# Altium schematic sheet main.SchDoc
size 317 x 281 mm; SheetNumber: 1; SheetTotal: 1
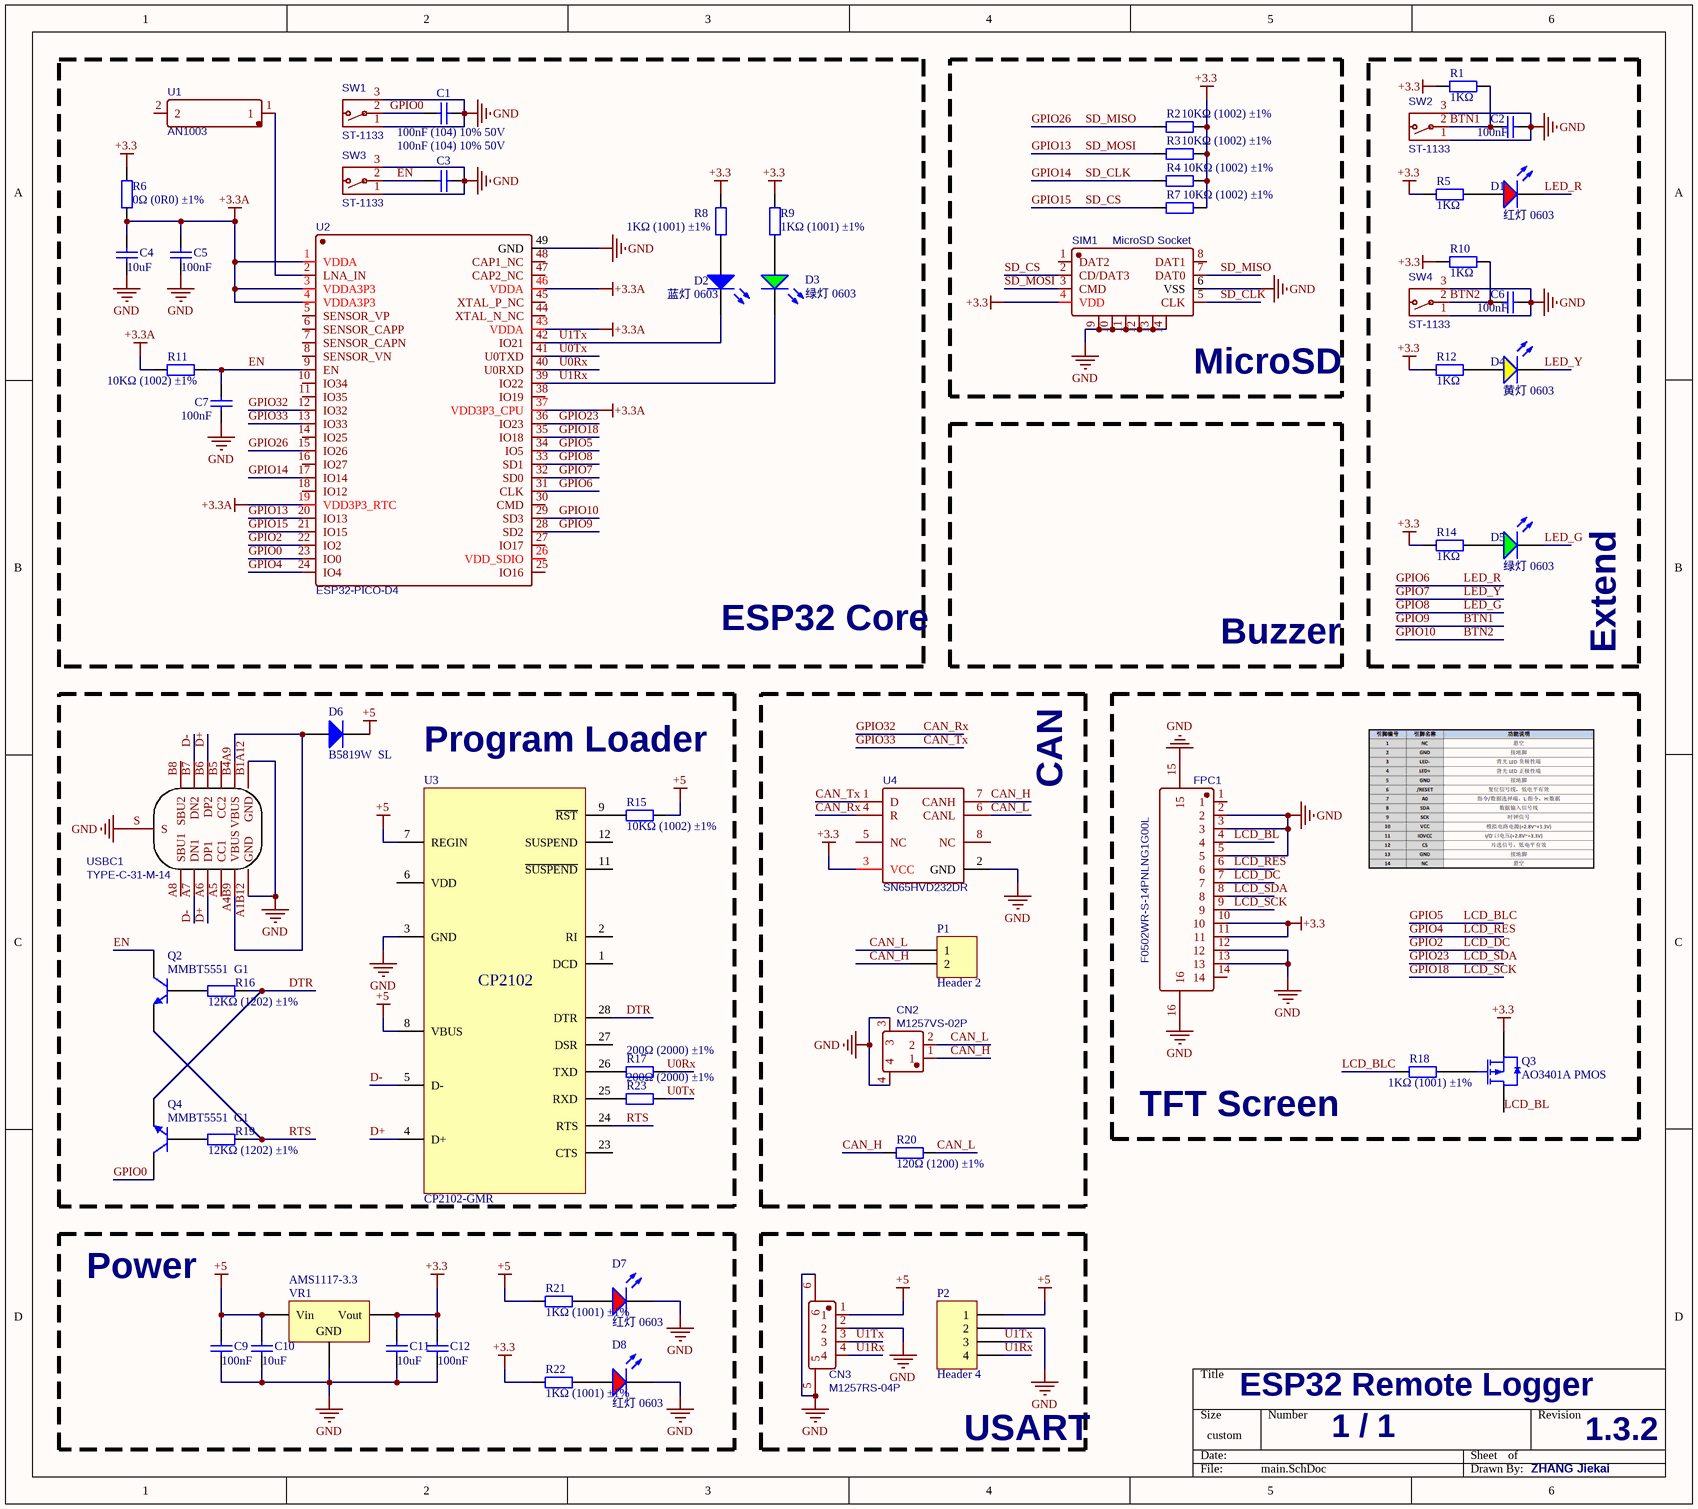
[diagram p0: main.SchDoc]

## Parts
C1  100nF (104) 10% 50V  [0603_C]
C2  100nF  [0603_C]
C3  100nF (104) 10% 50V  [0603_C]
C4  10uF  [0603_C]
C5  100nF  [0603_C]
C6  100nF  [0603_C]
C7  100nF  [0603_C]
C9  100nF  [0603_C]
C10  10uF  [0603_C]
C11  10uF  [0603_C]
C12  100nF  [0603_C]
CN2  M1257VS-02P  [CONN-SMD_P1.25_M1257VS-02P]
CN3  M1257RS-04P  [CONN-SMD_M1257RS-04P]
D1  红灯 0603  [0603_LED_S1]
D2  蓝灯 0603  [0603_LED_S1]
D3  绿灯 0603  [0603_LED_S1]
D4  黄灯 0603  [0603_LED_S1]
D5  绿灯 0603  [0603_LED_S1]
D6  B5819W  SL  [SOD-123]
D7  红灯 0603  [0603_LED_S1]
D8  红灯 0603  [0603_LED_S1]
FPC1  F0502WR-S-14PNLNG1G00L  [FPC-SMD_P0.50-14P_F0500WR-S]
P1  Header 2  [HDR1X2]
P2  Header 4  [HDR1X4]
Q2  MMBT5551  G1  [SOT-23(SOT-23-3)]
Q3  AO3401A PMOS  [SOT-23-3L]
Q4  MMBT5551  G1  [SOT-23(SOT-23-3)]
R1  1KΩ  [0603_R]
R2  10KΩ (1002) ±1%  [0603_R]
R3  10KΩ (1002) ±1%  [0603_R]
R4  10KΩ (1002) ±1%  [0603_R]
R5  1KΩ  [0603_R]
R6  0Ω (0R0) ±1%  [0603_R]
R7  10KΩ (1002) ±1%  [0603_R]
R8  1KΩ (1001) ±1%  [0603_R]
R9  1KΩ (1001) ±1%  [0603_R]
R10  1KΩ  [0603_R]
R11  10KΩ (1002) ±1%  [0603_R]
R12  1KΩ  [0603_R]
R14  1KΩ  [0603_R]
R15  10KΩ (1002) ±1%  [0603_R]
R16  12KΩ (1202) ±1%  [0603_R]
R17  200Ω (2000) ±1%  [0603_R]
R18  1KΩ (1001) ±1%  [0603_R]
R19  12KΩ (1202) ±1%  [0603_R]
R20  120Ω (1200) ±1%  [0603_R]
R21  1KΩ (1001) ±1%  [0603_R]
R22  1KΩ (1001) ±1%  [0603_R]
R23  200Ω (2000) ±1%  [0603_R]
SIM1  MicroSD Socket  [SIM-SMD_8P-1040310811]
SW1  ST-1133  [KEY-SMD_ST-1133]
SW2  ST-1133  [KEY-SMD_ST-1133]
SW3  ST-1133  [KEY-SMD_ST-1133]
SW4  ST-1133  [KEY-SMD_ST-1133]
U1  AN1003  [ANT-SMD_L10.3-W3.0]
U2  ESP32-PICO-D4  [QFN-48_L7.0-W7.0-P0.50-BL-EP5.4]
U3  CP2102-GMR  [QFN-28_5x5x05P]
U4  SN65HVD232DR  [SOIC-8_L5.0-W4.0-P1.27-LS6.0-BL]
USBC1  TYPE-C-31-M-14  [USB-C-SMD_12P-P0.50-H-F_TYPE-C-31-M-14]
VR1  AMS1117-3.3  [SOT-223]

## Blocks framed on the sheet
ESP32 Core: C1 C3-C5 C7 D2 D3 R6 R8 R9 R11 SW1 SW3 U1 U2
MicroSD: R2-R4 R7 SIM1
Extend: C2 C6 D1 D4 D5 R1 R5 R10 R12 R14 SW2 SW4
Program Loader: D6 Q2 Q4 R15-R17 R19 R23 U3 USBC1
CAN: CN2 P1 R20 U4
TFT Screen: FPC1 Q3 R18
Power: C9-C12 D7 D8 R21 R22 VR1
USART: CN3 P2

## Nets
+3.3: C11.2 C12.2 FPC1.10 FPC1.11 Q3.2(S) R1.2 R2.2 R3.2 R4.2 R5.2 R6.2 R7.2 R8.2 R9.2 R10.2 R12.2 R14.2 R22.1 SIM1.4(VDD) U4.3(VCC) VR1.2(Vout)
+3.3A: C4.2 C5.2 R6.1 R11.1 U2.1(VDDA) U2.3(VDDA3P3) U2.4(VDDA3P3) U2.19(VDD3P3_RTC) U2.37(VDD3P3_CPU) U2.43(VDDA) U2.46(VDDA)
+5: C9.2 C10.2 CN3.1 D6.2(K) P2.1 R15.2 R21.1 U3.7(REGIN) U3.8(VBUS) VR1.3(Vin)
GND: C1.2 C2.2 C3.2 C4.1 C5.1 C6.2 C7.1 C9.1 C10.1 C11.1 C12.1 CN2.3 CN2.4 CN3.2 CN3.5 CN3.6 D7.K D8.K FPC1.2 FPC1.3 FPC1.5 FPC1.12 FPC1.13 FPC1.15 FPC1.16 P2.2 SIM1.6(VSS) SIM1.9 SIM1.10 SIM1.11 SIM1.12 SIM1.13 SIM1.14 SW1.1 SW1.3 SW2.1 SW2.3 SW3.1 SW3.3 SW4.1 SW4.3 U2.49(GND) U3.3(GND) U4.2(GND) USBC1.A1B12(GND) USBC1.B1A12(GND) USBC1.S VR1.1(GND)
BTN1: C2.1 R1.1 SW2.2 U2.28(SD2)  [also labelled GPIO9]
BTN2: C6.1 R10.1 SW4.2 U2.29(SD3)  [also labelled GPIO10]
CAN_H: CN2.1 P1.2 R20.1 U4.7(CANH)
CAN_L: CN2.2 P1.1 R20.2 U4.6(CANL)
CAN_Rx: U2.12(IO32) U4.4(R)  [also labelled GPIO32]
CAN_Tx: U2.13(IO33) U4.1(D)  [also labelled GPIO33]
D+: U3.4(D+) USBC1.A6(DP1) USBC1.B6(DP2)
D-: U3.5(D-) USBC1.A7(DN1) USBC1.B7(DN2)
DTR: Q4.2(E) R16.2 U3.28(DTR)
EN: C3.1 C7.2 Q2.3(C) R11.2 SW3.2 U2.9(EN)
GPIO0: C1.1 Q4.3(C) SW1.2 U2.23(IO0)
GPIO2: FPC1.7 U2.22(IO2)  [also labelled LCD_DC]
GPIO4: FPC1.6 U2.24(IO4)  [also labelled LCD_RES]
GPIO5: R18.1 U2.34(IO5)  [also labelled LCD_BLC]
GPIO6: D1.K U2.31(CLK)  [also labelled LED_R]
GPIO7: D4.K U2.32(SD0)  [also labelled LED_Y]
GPIO8: D5.K U2.33(SD1)  [also labelled LED_G]
GPIO13: R3.1 SIM1.3(CMD) U2.20(IO13)  [also labelled SD_MOSI]
GPIO14: R4.1 SIM1.5(CLK) U2.17(IO14)  [also labelled SD_CLK]
GPIO15: R7.1 SIM1.2(CD/DAT3) U2.21(IO15)  [also labelled SD_CS]
GPIO18: FPC1.9 U2.35(IO18)  [also labelled LCD_SCK]
GPIO23: FPC1.8 U2.36(IO23)  [also labelled LCD_SDA]
GPIO26: R2.1 SIM1.7(DAT0) U2.15(IO26)  [also labelled SD_MISO]
LCD_BL: FPC1.4 Q3.3(D)
RTS: Q2.2(E) R19.2 U3.24(RTS)
U0Rx: R17.2 U2.40(U0RXD)
U0Tx: R23.2 U2.41(U0TXD)
U1Rx: CN3.4 D3.K P2.4 U2.39(IO22)
U1Tx: CN3.3 D2.K P2.3 U2.42(IO21)
NetD1_A: D1.A R5.1
NetD2_A: D2.A R8.1
NetD3_A: D3.A R9.1
NetD4_A: D4.A R12.1
NetD5_A: D5.A R14.1
NetD6_1: D6.1(A) USBC1.A4B9(VBUS) USBC1.B4A9(VBUS)
NetD7_A: D7.A R21.2
NetD8_A: D8.A R22.2
NetQ2_1: Q2.1(B) R16.1
NetQ3_1: Q3.1(G) R18.2
NetQ4_1: Q4.1(B) R19.1
NetR15_1: R15.1 U3.9(~{RST})
NetR17_1: R17.1 U3.26(TXD)
NetR23_1: R23.1 U3.25(RXD)
NetU1_1: U1.1 U2.2(LNA_IN)

Not connected (* = marked no-connect by the designer): FPC1 1 14; SIM1 1(DAT2) 8(DAT1); U1 2; U2 5(SENSOR_VP) 6(SENSOR_CAPP) 7(SENSOR_CAPN) 8(SENSOR_VN) 10(IO34) 11(IO35) 14(IO25) 16(IO27) 18(IO12) 25(IO16) 26(VDD_SDIO) 27(IO17) 30(CMD) 38(IO19) 44(XTAL_N_NC) 45(XTAL_P_NC) 47(CAP2_NC) 48(CAP1_NC); U3 1(DCD) 2(RI) 6(VDD) 11(~{SUSPEND}) 12(SUSPEND) 23(CTS) 27(DSR); U4 5(NC) 8(NC); USBC1 A5(CC1) A8(SBU1) B5(CC2) B8(SBU2)

## Notes on the sheet
- Buzzer
- ESP32 Remote Logger
- 1 / 1
- 1.3.2
- ZHANG Jiekai
- (in symbol CP2102-GMR_[C6568]) CP2102

## Library data of the parts
C1-C3 C5-C7 C9 C12 = 0603 100nF (104) 10% 50V: 贴片电容; ComponentLink1Description: 供应商链接; ComponentLink1URL: http://www.szlcsc.com/product/details_15331.html; Package: 0603; Supplier: LC; SuppliersPartNumber: C14663
C4 C10 C11 = 0603 10uF (106) 10% 10V: 贴片电容; ComponentLink1Description: 供应商链接; ComponentLink1URL: http://www.szlcsc.com/product/details_20411.html; Package: 0603; Supplier: LC; SuppliersPartNumber: C19702
CN2 = M1257VS-02P: BOM_Manufacturer: XFCN; Contributor: LCSC; BOM_Supplier: LCSC; BOM_Supplier Part: C541819; BOM_Manufacturer Part: M1257VS-02P; BOM_JLCPCB Part Class: Extended Part; spicePre: C; spiceSymbolName: M1257VS-02P
CN3 = M1257RS-04P: BOM_Manufacturer: XFCN; Contributor: LCSC; BOM_Supplier: LCSC; BOM_Supplier Part: C541828; BOM_Manufacturer Part: M1257RS-04P; BOM_JLCPCB Part Class: Extended Part; spicePre: C; spiceSymbolName: M1257RS-04P
D1 D7 D8 = 0603 红灯: 发光二极管; ComponentLink1Description: 供应商链接; ComponentLink1URL: http://www.szlcsc.com/product/details_2659.html; Package: 0603; Supplier: LC; SuppliersPartNumber: C2286
D2 = 0603 蓝灯: 发光二极管; ComponentLink1Description: 供应商链接; ComponentLink1URL: http://www.szlcsc.com/product/details_73150.html; Package: 0603; Supplier: LC; SuppliersPartNumber: C72041
D3 D5 = 0603 绿灯: 发光二极管; ComponentLink1Description: 供应商链接; ComponentLink1URL: http://www.szlcsc.com/product/details_73152.html; Package: 0603; Supplier: LC; SuppliersPartNumber: C72043
D4 = 0603 黄灯: 发光二极管; ComponentLink1Description: 供应商链接; ComponentLink1URL: http://www.szlcsc.com/product/details_73147.html; Package: 0603; Supplier: LC; SuppliersPartNumber: C72038
D6 = SOD-123 B5819W  SL: 肖特基二极管; ComponentLink1Description: 供应商链接; ComponentLink1URL: http://www.szlcsc.com/product/details_9093.html; Package: SOD-123; Supplier: LC; SuppliersPartNumber: C8598
FPC1 = F0502WR-S-14PNLNG1G00L: BOM_Manufacturer: Joint Tech Elec; Contributor: LCSC; BOM_Supplier: LCSC; BOM_Supplier Part: C247902; BOM_Manufacturer Part: F0502WR-S-14PNLNG1G00L; BOM_JLCPCB Part Class: Extended Part; spicePre: F; spiceSymbolName: F0502WR-S-14PNLNG1G00L
P1 = Header 2: Header, 2-Pin; LatestRevisionDate: 17-Jul-2002; LatestRevisionNote: Re-released for DXP Platform.; Publisher: Altium Limited
P2 = Header 4: Header, 4-Pin; LatestRevisionDate: 17-Jul-2002; LatestRevisionNote: Re-released for DXP Platform.; Publisher: Altium Limited
Q2 Q4 = SOT-23 MMBT5551  G1: 三极管; ComponentLink1Description: 供应商链接; ComponentLink1URL: http://www.szlcsc.com/product/details_2502.html; Package: SOT-23; Supplier: LC; SuppliersPartNumber: C2145
Q3 = AO3401A P道沟 X13A15 SOT-23: MOS(场效应管); ComponentLink1Description: 供应商链接; ComponentLink1URL: http://www.szlcsc.com/product/details_15801.html; Package: SOT-23; Supplier: LC; SuppliersPartNumber: C15127
R1 R5 R8-R10 R12 R14 R18 R21 R22 = 0603 1KΩ (1001) 1%: 贴片电阻; ComponentLink1Description: 供应商链接; ComponentLink1URL: http://www.szlcsc.com/product/details_21904.html; Package: 0603; Supplier: LC; SuppliersPartNumber: C21190
R2-R4 R7 R11 R15 = 0603 10KΩ (1002) 1%: 贴片电阻; ComponentLink1Description: 供应商链接; ComponentLink1URL: http://www.szlcsc.com/product/details_26547.html; Package: 0603; Supplier: LC; SuppliersPartNumber: C25804
R6 = 0603 0Ω (0R0) 1%: 贴片电阻; ComponentLink1Description: 供应商链接; ComponentLink1URL: http://www.szlcsc.com/product/details_21903.html; Package: 0603; Supplier: LC; SuppliersPartNumber: C21189
R16 R19 = 0603 12KΩ (1202) 1%: 贴片电阻; ComponentLink1Description: 供应商链接; ComponentLink1URL: http://www.szlcsc.com/product/details_23517.html; Package: 0603; Supplier: LC; SuppliersPartNumber: C22790
R17 R23 = 0603 200Ω (2000) 1%: 贴片电阻; ComponentLink1Description: 供应商链接; ComponentLink1URL: http://www.szlcsc.com/product/details_8708.html; Package: 0603; Supplier: LC; SuppliersPartNumber: C8218
R20 = 0603 120Ω (1200) 1%: 贴片电阻; ComponentLink1Description: 供应商链接; ComponentLink1URL: http://www.szlcsc.com/product/details_23514.html; Package: 0603; Supplier: LC; SuppliersPartNumber: C22787
SIM1 = 1040310811: BOM_Manufacturer: MOLEX; Contributor: LCSC; BOM_Supplier: LCSC; BOM_Supplier Part: C585350; BOM_Manufacturer Part: 1040310811; BOM_JLCPCB Part Class: Extended Part; spicePre: S; spiceSymbolName: 1040310811
SW1-SW4 = ST-1133: BOM_Manufacturer: RI SHENG; Contributor: LCSC; BOM_Supplier: LCSC; BOM_Supplier Part: C589182; BOM_Manufacturer Part: ST-1133; BOM_JLCPCB Part Class: Extended Part; spicePre: S; spiceSymbolName: ST-1133
U1 = AN1003: BOM_Manufacturer: Rainsun microwave Tech; Contributor: LCSC; BOM_Supplier: LCSC; BOM_Supplier Part: C239240; BOM_Manufacturer Part: AN1003; BOM_JLCPCB Part Class: Extended Part; spicePre: U; spiceSymbolName: AN1003
U2 = ESP32-PICO-D4: BOM_Manufacturer: Espressif Systems; Contributor: LCSC; BOM_Supplier: LCSC; BOM_Supplier Part: C193707; BOM_Manufacturer Part: ESP32-PICO-D4; BOM_JLCPCB Part Class: Extended Part; spicePre: U; spiceSymbolName: ESP32-PICO-D4
U3 = CP2102-GMR_[C6568]: USB; ComponentLink1Description: 供应商链接; ComponentLink1URL: http://www.szlcsc.com/product/details_7033.html; Package: QFN-28_5x5x05P; Supplier: LC; SuppliersPartNumber: C6568
U4 = SN65HVD232DR: BOM_Manufacturer: TI; BOM_Supplier: LCSC; BOM_Manufacturer Part: SN65HVD232DR; BOM_Supplier Part: C30530; BOM_JLCPCB Part Class: Extended Part; spicePre: U; spiceSymbolName: SN65HVD232DR
USBC1 = TYPE-C-31-M-14: BOM_Manufacturer: Rectangular Connectors - Contacts; Contributor: LCSC; BOM_Supplier: LCSC; BOM_Supplier Part: C223907; BOM_Manufacturer Part: TYPE-C-31-M-14; BOM_JLCPCB Part Class: Extended Part; spicePre: U; spiceSymbolName: TYPE-C-31-M-14
VR1 = SOT-223 AMS1117-3.3: 低压差线性稳压(LDO); ComponentLink1Description: 供应商链接; ComponentLink1URL: http://www.szlcsc.com/product/details_6652.html; Package: SOT-223; Supplier: LC; SuppliersPartNumber: C6186